# EAGLE design Fyve_Sicks (EAGLE 9.6.0)
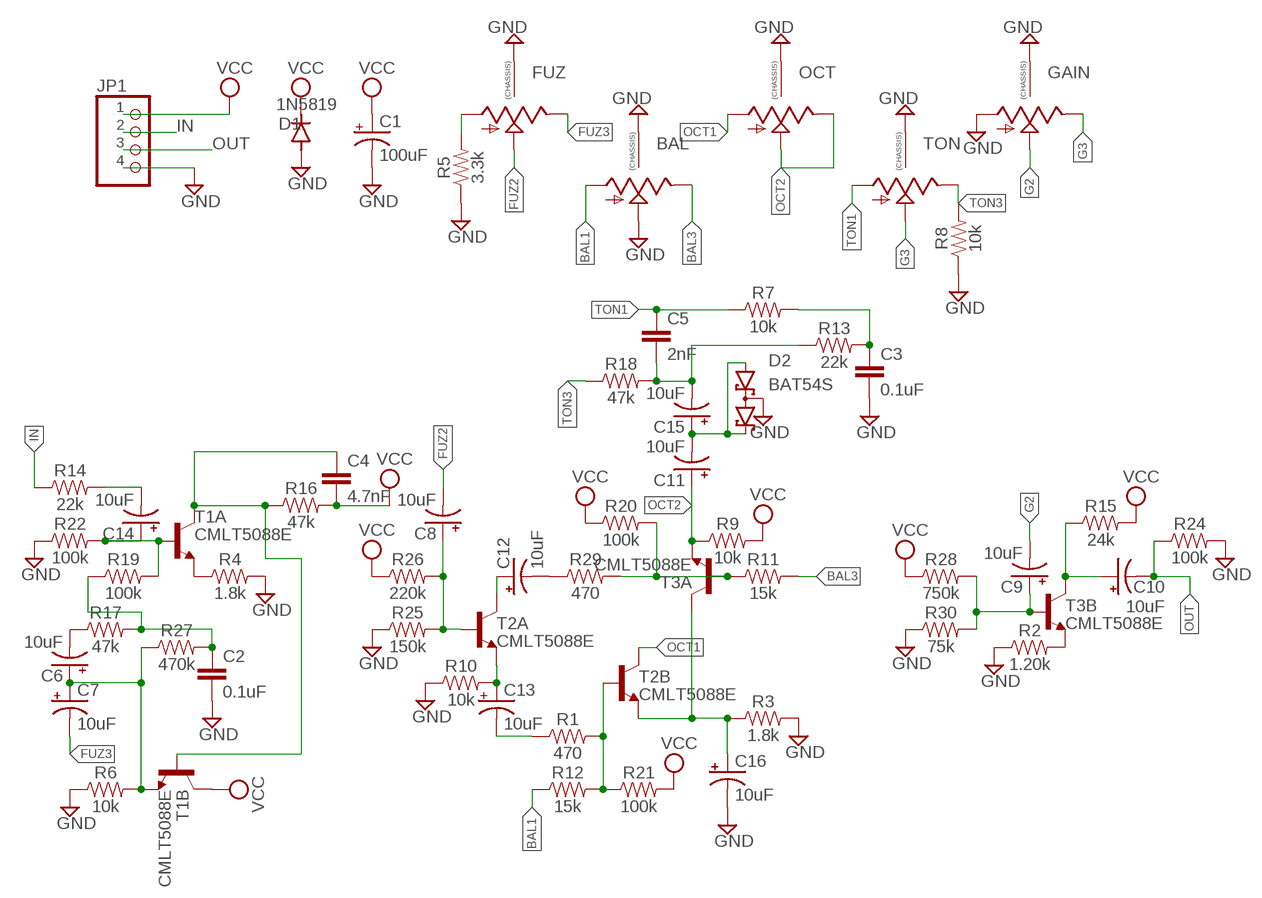
[diagram p0: schematic, sheet 1]

## Parts
BAL  9MM_SNAP-IN_POT_CHASSIS  [9MM_SNAP-IN_POT]
C1  100uF  CAP_SMD+THRUPAN_B  [PAN_B_SMD+THRU]
C2  0.1uF  0.1UF-0603-25V-(+80/-20%)  [0603]
C3  0.1uF  0.1UF-0603-25V-(+80/-20%)  [0603]
C4  4.7nF  4.7PF-0603-50V-5%  [0603]
C5  2nF  2.2NF/2200PF-0603-50V-10%  [0603]
C6  10uF  10UF-POLAR-EIA3528-20V-10%(TANT)  [EIA3528]
C7  10uF  10UF-POLAR-EIA3528-20V-10%(TANT)  [EIA3528]
C8  10uF  10UF-POLAR-EIA3528-20V-10%(TANT)  [EIA3528]
C9  10uF  10UF-POLAR-EIA3528-20V-10%(TANT)  [EIA3528]
C10  10uF  10UF-POLAR-EIA3528-20V-10%(TANT)  [EIA3528]
C11  10uF  10UF-POLAR-EIA3528-20V-10%(TANT)  [EIA3528]
C12  10uF  10UF-POLAR-EIA3528-20V-10%(TANT)  [EIA3528]
C13  10uF  10UF-POLAR-EIA3528-20V-10%(TANT)  [EIA3528]
C14  10uF  10UF-POLAR-EIA3528-20V-10%(TANT)  [EIA3528]
C15  10uF  10UF-POLAR-EIA3528-20V-10%(TANT)  [EIA3528]
C16  10uF  10UF-POLAR-EIA3528-20V-10%(TANT)  [EIA3528]
D1  1N5819  DIODE-SOD123  [SOD123]
D2  BAT54S  [SOT23]
FUZ  9MM_SNAP-IN_POT_CHASSIS  [9MM_SNAP-IN_POT]
GAIN  9MM_SNAP-IN_POT_CHASSIS  [9MM_SNAP-IN_POT]
JP1  PINHD-1X4  [1X04]
OCT  9MM_SNAP-IN_POT_CHASSIS  [9MM_SNAP-IN_POT]
R1  470  470OHM-0603-1/10W-1%  [0603]
R2  1.20k  1.20KOHM-0603-1/10W-1%  [0603]
R3  1.8k  1.8KOHM-0603-1/10W-1%  [0603]
R4  1.8k  1.8KOHM-0603-1/10W-1%  [0603]
R5  3.3k  3.3KOHM-0603-1/10W-1%  [0603]
R6  10k  10KOHM-0603-1/10W-1%  [0603]
R7  10k  10KOHM-0603-1/10W-1%  [0603]
R8  10k  10KOHM-0603-1/10W-1%  [0603]
R9  10k  10KOHM-0603-1/10W-1%  [0603]
R10  10k  10KOHM-0603-1/10W-1%  [0603]
R11  15k  15KOHM-0603-1/10W-1%  [0603]
R12  15k  15KOHM-0603-1/10W-1%  [0603]
R13  22k  22KOHM-0603-1/10W-1%  [0603]
R14  22k  22KOHM-0603-1/10W-1%  [0603]
R15  24k  22KOHM-0603-1/10W-1%  [0603]
R16  47k  47KOHM-0603-1/10W-1%  [0603]
R17  47k  47KOHM-0603-1/10W-1%  [0603]
R18  47k  47KOHM-0603-1/10W-1%  [0603]
R19  100k  100KOHM-0603-1/10W-1%  [0603]
R20  100k  100KOHM-0603-1/10W-1%  [0603]
R21  100k  100KOHM-0603-1/10W-1%  [0603]
R22  100k  100KOHM-0603-1/10W-1%  [0603]
R24  100k  100KOHM-0603-1/10W-1%  [0603]
R25  150k  150KOHM-0603-1/10W-1%  [0603]
R26  220k  220KOHM-0603-1/10W-1%  [0603]
R27  470k  470OHM-0603-1/10W-1%  [0603]
R28  750k  750OHM-0603-1/10W-1%  [0603]
R29  470  470OHM-0603-1/10W-1%  [0603]
R30  75k  75KOHM-0603-1/10W-1%  [0603]
T1  CMLT5088E  [SOT563]
T2  CMLT5088E  [SOT563]
T3  CMLT5088E  [SOT563]
TON  9MM_SNAP-IN_POT_CHASSIS  [9MM_SNAP-IN_POT]

## Nets
BAL1: BAL.1(A) R12.1
BAL3: BAL.3(E) R11.2
FUZ2: C8.C(-) FUZ.2(S)
FUZ3: C7.C(-) FUZ.3(E)
G2: C9.C(-) GAIN.2(S)
G3: GAIN.3(E) TON.2(S)
GND: BAL.2(S) BAL.CHASSIS1 BAL.CHASSIS2 C1.- C1.--(-) C2.2 C3.2 C16.C(-) D1.A D2.3(C1A2) FUZ.CHASSIS1 FUZ.CHASSIS2 GAIN.1(A) GAIN.CHASSIS1 GAIN.CHASSIS2 JP1.4 OCT.CHASSIS1 OCT.CHASSIS2 R2.1 R3.2 R4.2 R5.1 R6.1 R8.1 R10.1 R22.1 R24.2 R25.1 R30.1 TON.CHASSIS1 TON.CHASSIS2
IN: JP1.2 R14.1
N$1: FUZ.1(A) R5.2
N$2: C13.C(-) R1.1
N$3: C2.1 R17.2 R19.1 R27.2
N$4: R1.2 R12.2 R21.1 T2.5(B:B)
N$5: R11.1 R20.2 R29.2 T3.2(A:B)
N$6: C12.C(-) R29.1
N$7: C12.A(+) T2.6(A:C)
N$8: C11.C(-) C15.A(+) D2.1(A1) D2.2(C2)
N$9: C5.2 C15.C(-) R13.1 R18.2
N$10: C3.1 R7.2 R13.2
N$11: C9.A(+) R28.2 R30.2 T3.5(B:B)
N$12: R2.2 T3.4(B:E)
N$13: C10.A(+) R15.1 T3.3(B:C)
N$14: C6.A(+) C7.A(+) R6.2 R27.1 T1.4(B:E)
N$15: C14.C(-) R14.2
N$16: C14.A(+) R19.2 R22.2 T1.2(A:B)
N$17: C6.C(-) R17.1
N$18: C8.A(+) R25.2 R26.2 T2.2(A:B)
N$19: R4.1 T1.1(A:E)
N$20: C13.A(+) R10.2 T2.1(A:E)
N$21: C4.1 R16.1 T1.5(B:B) T1.6(A:C)
N$22: C16.A(+) R3.1 T2.4(B:E) T3.6(A:C)
OCT1: OCT.1(A) T2.3(B:C)
OCT2: C11.A(+) OCT.2(S) OCT.3(E) R9.1 T3.1(A:E)
OUT: C10.C(-) JP1.3 R24.1
TON1: C5.1 R7.1 TON.1(A)
TON3: R8.2 R18.1 TON.3(E)
VCC: C1.+ C1.++(+) C4.2 D1.C JP1.1 R9.2 R15.2 R16.2 R20.1 R21.2 R26.1 R28.1 T1.3(B:C)

## Library data of the parts
BAL FUZ GAIN OCT TON = MusicThingModular:9MM_SNAP-IN_POT_CHASSIS: 9mm vertical snap-in pot, Alpha / Panasonic style, with a connection to the metal chassis for grounding
C1 = MusicThingModular:CAP_SMD+THRU
C2 C3 = SparkFun-Capacitors:0.1UF: 0.1µF ceramic capacitors A capacitor is a passive two-terminal electrical component used to store electrical energy temporarily in an electric field.; PROD_ID: CAP-00810
C4 = SparkFun-Capacitors:4.7PF: 4.7pF ceramic capacitors A capacitor is a passive two-terminal electrical component used to store electrical energy temporarily in an electric field.; PROD_ID: CAP-07880; VALUE: 4.7pF
C5 = SparkFun-Capacitors:2.2NF/2200PF: 2.2nF/2,200pF ceramic capacitors A capacitor is a passive two-terminal electrical component used to store electrical energy temporarily in an electric field.; PROD_ID: CAP-07877; VALUE: 2.2nF
C6-C16 = SparkFun-Capacitors:10UF-POLAR: 10.0µF polarized capacitors A capacitor is a passive two-terminal electrical component used to store electrical energy temporarily in an electric field.; PROD_ID: CAP-08063
D1 = diode:DIODE-: DIODE
D2 = diode:BAT54S: Schottky Diodes Pin connection corrected 2011-05-04 Source: Fairchild .. BAT54.pdf
JP1 = Connector:PINHD-1X4: PIN HEADER; CATEGORY: CONNECTOR; SUB-CATEGORY: PIN-HEADER
R1 R29 = SparkFun-Resistors:470OHM: 470Ω resistor A resistor is a passive two-terminal electrical component that implements electrical resistance as a circuit element. Resistors act to reduce current flow, and, at the same time, act to lower voltage levels within circuits. - Wikipedia; PROD_ID: RES-07869
R2 = SparkFun-Resistors:1.20KOHM: 1.20kΩ resistor A resistor is a passive two-terminal electrical component that implements electrical resistance as a circuit element. Resistors act to reduce current flow, and, at the same time, act to lower voltage levels within circuits. - Wikipedia; PROD_ID: RES-08413
R3 R4 = SparkFun-Resistors:1.8KOHM: 1.8kΩ resistor A resistor is a passive two-terminal electrical component that implements electrical resistance as a circuit element. Resistors act to reduce current flow, and, at the same time, act to lower voltage levels within circuits. - Wikipedia; PROD_ID: RES-09119
R5 = SparkFun-Resistors:3.3KOHM: 3.3kΩ resistor A resistor is a passive two-terminal electrical component that implements electrical resistance as a circuit element. Resistors act to reduce current flow, and, at the same time, act to lower voltage levels within circuits. - Wikipedia; PROD_ID: RES-07851
R6-R10 = SparkFun-Resistors:10KOHM: 10kΩ resistor A resistor is a passive two-terminal electrical component that implements electrical resistance as a circuit element. Resistors act to reduce current flow, and, at the same time, act to lower voltage levels within circuits. - Wikipedia; PROD_ID: RES-00824
R11 R12 = SparkFun-Resistors:15KOHM: 15kΩ resistor A resistor is a passive two-terminal electrical component that implements electrical resistance as a circuit element. Resistors act to reduce current flow, and, at the same time, act to lower voltage levels within circuits. - Wikipedia; PROD_ID: RES-07854
R13 R14 = SparkFun-Resistors:22KOHM: 22kΩ resistor A resistor is a passive two-terminal electrical component that implements electrical resistance as a circuit element. Resistors act to reduce current flow, and, at the same time, act to lower voltage levels within circuits. - Wikipedia; PROD_ID: RES-07853
R15 = SparkFun-Resistors:22KOHM: 22kΩ resistor A resistor is a passive two-terminal electrical component that implements electrical resistance as a circuit element. Resistors act to reduce current flow, and, at the same time, act to lower voltage levels within circuits. - Wikipedia; PROD_ID: RES-07853; VALUE: 22k
R16-R18 = SparkFun-Resistors:47KOHM: 47kΩ resistor A resistor is a passive two-terminal electrical component that implements electrical resistance as a circuit element. Resistors act to reduce current flow, and, at the same time, act to lower voltage levels within circuits. - Wikipedia; PROD_ID: RES-07871
R19-R22 R24 = SparkFun-Resistors:100KOHM: 100kΩ resistor A resistor is a passive two-terminal electrical component that implements electrical resistance as a circuit element. Resistors act to reduce current flow, and, at the same time, act to lower voltage levels within circuits. - Wikipedia; PROD_ID: RES-07828
R25 = SparkFun-Resistors:150KOHM: 150kΩ resistor A resistor is a passive two-terminal electrical component that implements electrical resistance as a circuit element. Resistors act to reduce current flow, and, at the same time, act to lower voltage levels within circuits. - Wikipedia; PROD_ID: RES-09117
R26 = SparkFun-Resistors:220KOHM: 220kΩ resistor A resistor is a passive two-terminal electrical component that implements electrical resistance as a circuit element. Resistors act to reduce current flow, and, at the same time, act to lower voltage levels within circuits. - Wikipedia; PROD_ID: RES-08969
R27 = SparkFun-Resistors:470OHM: 470Ω resistor A resistor is a passive two-terminal electrical component that implements electrical resistance as a circuit element. Resistors act to reduce current flow, and, at the same time, act to lower voltage levels within circuits. - Wikipedia; PROD_ID: RES-07869; VALUE: 470
R28 = SparkFun-Resistors:750OHM: 750Ω resistor A resistor is a passive two-terminal electrical component that implements electrical resistance as a circuit element. Resistors act to reduce current flow, and, at the same time, act to lower voltage levels within circuits. - Wikipedia; PROD_ID: RES-07824; VALUE: 750
R30 = SparkFun-Resistors:75KOHM: 75Ω resistor A resistor is a passive two-terminal electrical component that implements electrical resistance as a circuit element. Resistors act to reduce current flow, and, at the same time, act to lower voltage levels within circuits. - Wikipedia; PROD_ID: RES-09737; VALUE: 75
T1-T3 = transistor-neu-to92:CMLT5088E: DUAL NPN/NPN L88 TRANSISTORS ENHANCED SPECIFICATION PICOmini(TM) SURFACE MOUNT Source: CMLT5078%20SERIES.pdf

## Board
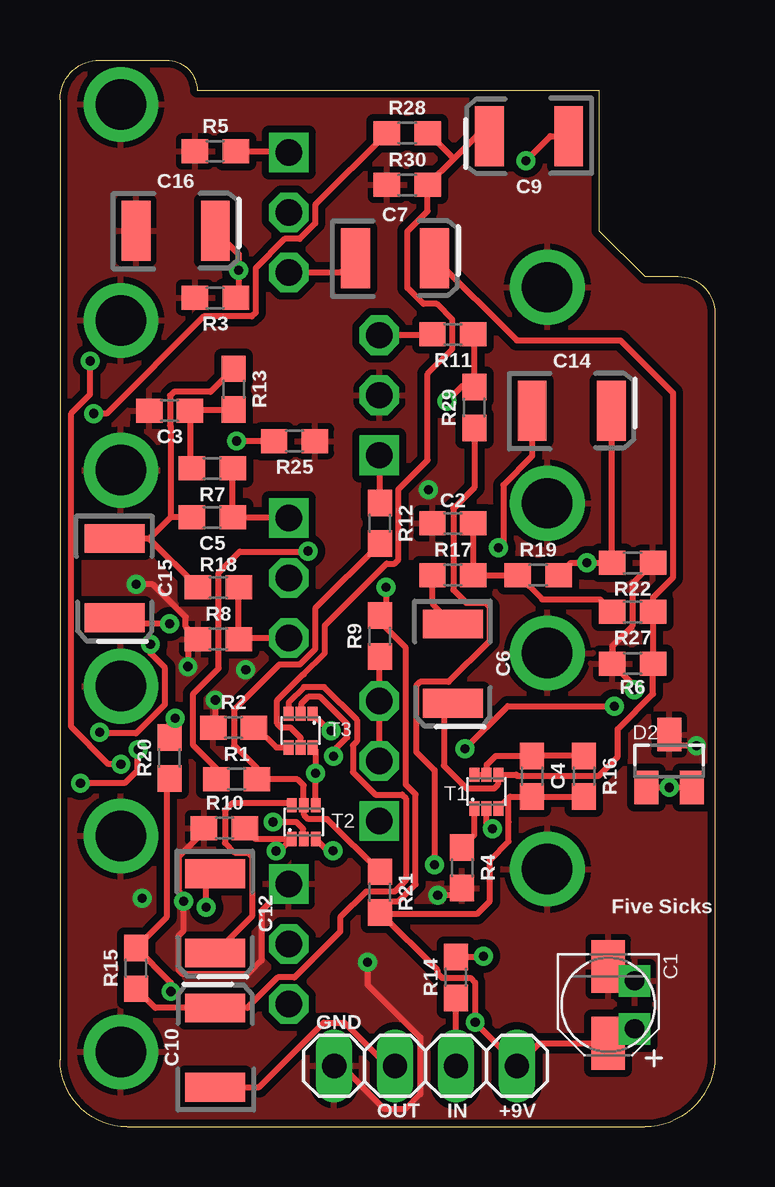
[diagram p1: board, top side]
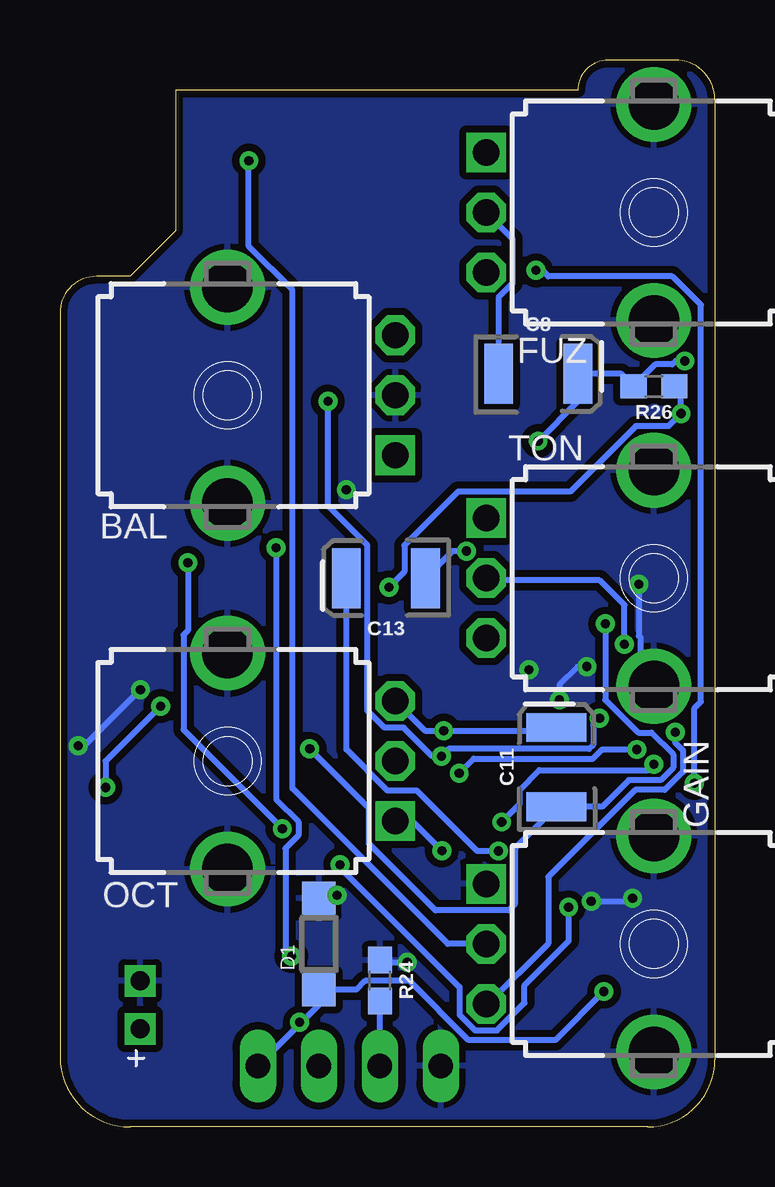
[diagram p2: board, bottom side, seen from below]

Size 27.3 x 44.45 mm. Coordinates in mm from the lower left corner, seen from the top.
Outline: 2.79,0 24.38,0 arc90 27.3,2.92 27.3,33.91 arc90 25.78,35.43 24.38,35.43 22.48,37.34 22.48,43.18 5.71,43.18 arc90 4.45,44.45 1.65,44.45 arc90 0,42.8 0,2.79 arc90 2.79,0
Copper layers (1*16): Top 0.035mm / dielectric 1.5mm / Bottom 0.035mm
Design rules "default *": minimum track width 6mil, minimum drill 0.35mm, track to track 6mil, track to pad 6mil, pad to pad 6mil, via to via 6mil, smd to smd 6mil, copper to edge 8mil, drill to drill 6mil, minimum pad ring 10mil, minimum via ring 8mil, stop-mask expansion 4mil, vias tented up to drill 0mil, thermal gap 10mil

### Footprints (pad centres in the part's own frame; a part is rotated, then mirrored left to right if it is on the bottom)
9MM_SNAP-IN_POT = drill 1.1 square: 1 -2.5,-7 | drill 1.1 octagon: 2 0,-7; 3 2.5,-7 | drill 2.1 pad 2.794: CHASSIS1 -4.5,0; CHASSIS2 4.5,0
PAN_B_SMD+THRU = smd 2.2 x 1.4: + 1.6,0; - -1.6,0 | drill 0.8 pad 0.9 square: ++ 1,1.1; -- -1,1.1
0603 = smd 1.1 x 1: 1 -0.85,0; 2 0.85,0
EIA3528 = smd 1.2 x 2.5: A 1.65,0; C -1.65,0
SOD123 = smd 1.4 x 1.4: A 1.9,0; C -1.9,0
SOT23 = smd 1 x 1.4: 1 -0.95,-1.1; 2 0.95,-1.1; 3 0,1.1
1X04 = drill 1.016 long: 1 -3.81,0; 2 -1.27,0; 3 1.27,0; 4 3.81,0
SOT563 = smd 0.4 x 0.6: 1 -0.5,-0.7; 2 0,-0.7; 3 0.5,-0.7; 4 0.5,0.7; 5 0,0.7; 6 -0.5,0.7

### Placement (x,y rotation side)
BAL  20.32,30.48 90 bottom
C1  22.86,5.08 270 top
C2  16.38,25.15 180 top
C3  4.57,29.84 180 top
C4  19.68,14.61 270 top
C5  6.35,25.4 180 top
C6  16.38,19.3 270 top
C7  13.97,36.2 0 top
C8  7.37,31.37 0 bottom
C9  19.56,41.27 180 top
C10  6.48,3.3 90 top
C11  6.6,14.99 90 bottom
C12  6.48,8.89 270 top
C13  13.72,22.86 180 bottom
C14  21.34,29.84 0 top
C15  2.29,22.86 270 top
C16  4.83,37.34 0 top
D1  16.51,7.62 90 bottom
D2  25.4,15.24 0 top
FUZ  2.54,38.1 270 bottom
GAIN  2.54,7.62 270 bottom
JP1  15.24,2.54 180 top
OCT  20.32,15.24 90 bottom
R1  7.37,14.48 0 top
R2  7.24,16.64 0 top
R3  6.48,34.54 180 top
R4  16.76,10.79 270 top
R5  6.48,40.64 0 top
R6  23.88,19.3 0 top
R7  6.35,27.43 180 top
R8  6.6,20.32 0 top
R9  13.34,20.45 90 top
R10  6.86,12.45 0 top
R11  16.38,33.02 180 top
R12  13.34,25.15 270 top
R13  7.24,30.73 270 top
R14  16.51,6.22 90 top
R15  3.17,6.6 90 top
R16  21.84,14.61 270 top
R17  16.38,22.99 0 top
R18  6.6,22.48 180 top
R19  19.94,22.99 0 top
R20  4.57,15.37 90 top
R21  13.34,9.78 270 top
R22  23.88,23.5 180 top
R24  13.97,6.1 90 bottom
R25  9.78,28.57 180 top
R26  2.54,30.86 180 bottom
R27  23.88,21.46 180 top
R28  14.48,41.4 0 top
R29  17.27,29.97 90 top
R30  14.48,39.24 0 top
T1  17.78,13.97 0 top
T2  10.16,12.7 0 top
T3  10.03,16.51 180 top
TON  2.54,22.86 270 bottom

### Tracks (layer width: path | path; a pad name or v marks a point on that pad's centre or on a via)
BAL1
  Top 0.254: BAL.1 13.32,26.01 R12.1
BAL3
  Top 0.254: R11.2 15.49,32.98 BAL.3
FUZ2
  Bottom 0.254: C8.C 9.02,34.56 8.44,35.14 8.44,37 FUZ.2
FUZ3
  Top 0.254: FUZ.3 11.72,35.6 C7.C
G2  (via drill 0.38)
  Top 0.254: v19.43,40.26 20.45,41.27 C9.C
  Bottom 0.254: GAIN.2 11.13,7.62 17.61,14.1 17.61,34.87 19.43,36.69 v19.43,40.26
G3  (via drill 0.38)
  Top 0.254: v1.65,16.43 1.69,16.4 3.17,16.4 4.38,17.6 4.38,19.12 3.77,19.73 v3.77,20.1
  Bottom 0.254: GAIN.3 9.46,5.12 6.95,7.63 6.95,10.41 3.33,14.03 2.09,14.03 1.33,14.79 1.33,15.69 1.65,16 v1.65,16.43 | TON.2 9.45,22.77 4.8,22.77 3.77,21.74 v3.77,20.1
GND  (via drill 0.38)
  Top 0.254: JP1.4 11.73,2.54 13.54,0.74 14.4,0.74 15.01,1.35 15.01,3.73 12.83,5.92 v12.83,6.86 | GAIN.1 8.41,8.99 8.41,6.93 7.84,6.36 5.11,6.36 4.95,6.52 4.95,7.96 5.16,8.16 v5.16,9.39 5.16,9.62 4.95,9.82 4.95,11.26 6.01,12.32 R10.1 | R22.1 23.86,22.62 23.86,20.85 23.03,20.02 R6.1 23.95,18.38 v23.95,18.21 | v26.54,15.88 25.86,15.88 D2.3 | v5.33,19.18 5.33,19.94 5.63,20.23 5.67,20.23 R8.1 5.25,20.83 5.25,21.23 3.87,22.61 v3.17,22.61 | v6.48,17.78 6.48,16.73 R2.1 | R4.2 16.47,9.65 v15.75,9.65
  Bottom 0.254: R24.2 13.88,6.86 v12.83,6.86 | v5.16,9.39 3.56,9.39 v3.43,9.53 | v23.95,18.21 26.29,15.88 v26.54,15.88 | v5.33,19.18 5.71,19.18 6.48,18.41 v6.48,17.78 | v3.17,22.61 3.17,20.46 3.1,20.38 3.1,18.92 TON.CHASSIS2 | v15.75,9.65 16.38,9.65 D1.A
  other vias: 15.37,26.54 7.75,19.05
  pour Bottom (isolate 0.305): -1.02,45.59 -1.02,-0.76 -0.64,-1.14 28.32,-1.14 28.57,-0.89 28.57,45.21 28.32,45.47 -0.89,45.47
  pour Top (isolate 0.305): -0.89,45.47 -0.89,-0.76 -0.64,-1.02 28.19,-1.02 28.57,-0.64 28.57,45.21 28.32,45.47
IN
  Top 0.254: JP1.2 R14.1
N$1
  Top 0.254: R5.2 9.5,40.64 FUZ.1
N$2  (via drill 0.38)
  Top 0.254: R1.1 6.52,14.94 5.56,15.89 5.56,18.05 6.62,19.11 6.62,23.09 7.49,23.96 10.33,23.96 v10.35,23.99
  Bottom 0.254: v10.35,23.99 10.94,23.99 C13.C
N$3
  Top 0.254: C2.1 R17.2 R19.1 20.11,21.97 22.52,21.97 R27.2
N$4
  Top 0.254: R21.1 11.14,12.82 10.34,12.82 10.18,12.98 10.18,13.38 T2.5 10.16,14.22 9.91,14.48 R1.2 8.22,14.94 7.26,15.89 7.26,17.38 9.13,19.26 10,19.26 10.64,19.9 10.64,21.61 R12.2
N$5  (via drill 0.38)
  Top 0.254: R29.2 17.27,30.86 | 17.27,30.86 17.27,32.98 R11.1 | v11.41,15.44 11.41,15.66 11.98,16.23 11.98,16.79 10.85,17.92 10.34,17.92 10.05,17.63 10.05,17.36 10.03,17.34 T3.2 | v16.13,30.23 16.76,30.86 17.27,30.86 | R20.2 4.57,16.78 v4.81,17.02
  Bottom 0.254: v16.13,30.23 16.13,25.87 14.49,24.23 14.49,17.34 13.78,16.64 12.98,16.64 11.79,15.44 v11.41,15.44 11.1,15.75 5.25,15.75 5.08,15.92 5.08,16.75 v4.81,17.02
N$6  (via drill 0.38)
  Top 0.254: R29.1 17.27,26.63 16.4,25.76 16.4,22.37 16.94,21.83 17.75,21.83 17.91,21.67 17.91,20.24 16.21,18.53 15.02,18.53 14.85,18.37 14.85,15.63 15.62,14.86 v15.62,10.92 | v6.1,9.14 6.1,10.16 C12.C
  Bottom 0.254: v6.1,9.14 6.1,7.75 7.94,5.91 7.94,5.16 9.08,4.02 10,4.02 10.64,4.66 10.64,5.82 15.62,10.79 v15.62,10.92
N$7
  Top 0.254: C12.A 8.01,8.77 8.01,11.26 7.84,11.42 7.29,11.42 6.88,11.83 6.88,13.19 7.17,13.48 9.58,13.48 T2.6
N$8  (via drill 0.38)
  Top 0.254: D2.1 v25.4,14.14 D2.2 | v4.57,20.95 2.54,20.95 C15.A | v16.89,15.75 18.67,17.53 v23.11,17.53
  Bottom 0.254: v4.57,20.95 4.57,17.79 3.2,16.42 2.64,16.42 1.74,15.52 1.74,14.96 2.26,14.44 3.59,14.44 4.7,13.34 C11.C 8.34,11.6 8.34,9.27 8.6,9.02 11.64,9.02 14.42,11.8 14.42,13.28 v16.89,15.75 | v23.11,17.53 25.4,15.24 v25.4,14.14
N$9
  Top 0.254: R18.2 3.72,24.51 | 3.72,24.51 C15.C | C5.2 4.61,25.4 | 4.61,25.4 3.72,24.51 | R13.1 6.28,30.62 4.76,30.62 4.59,30.46 4.59,29.23 4.61,29.21 4.61,25.4
N$10
  Top 0.254: R7.2 5.42,27.51 C3.1 5.46,29.88 R13.2
N$11
  Top 0.254: 16.43,40.34 R30.2 15.33,38.15 14.49,37.31 14.49,34.96 15.16,34.28 15.71,34.28 16.36,33.64 16.36,32.4 15.33,31.37 15.33,27.77 14.11,26.56 14.11,23.63 13.95,23.47 13.62,23.47 11.05,20.89 11.05,19.73 10.17,18.85 10.13,18.85 9.05,17.77 9.05,16.79 9.22,16.63 9.61,16.63 10.03,16.2 T3.5 | 16.43,40.34 17.36,41.27 C9.A | R28.2 15.37,41.4 16.43,40.34
N$12
  Top 0.254: R2.2 8.2,16.64 9.03,15.81 T3.4
N$13
  Top 0.254: R15.1 3.98,4.95 C10.A 7.81,4.95 9.08,6.22 9.78,6.22 11.68,8.13 11.68,8.72 12.76,9.8 13.95,9.8 14.42,10.27 14.42,13.68 14.26,13.84 13.15,13.84 12.22,14.78 12.22,15.89 12.38,16.06 12.38,16.96 11.02,18.32 10.18,18.32 9.53,17.68 T3.3
N$14
  Top 0.254: C7.A 19.05,32.77 23.37,32.77 25.55,30.58 25.55,22.88 24.73,22.05 R27.1 R6.2 24.73,18.03 23.26,16.57 23.26,15.42 22.46,14.63 19.07,14.63 19.02,14.67 T1.4 18.26,14.65 18.26,14.25 18.1,14.09 16.96,14.09 16,15.05 16,17.27 C6.A
N$15  (via drill 0.38)
  Top 0.254: C14.C 19.69,27.94 18.48,26.74 18.48,24.32 v18.29,24.13 | v17.65,7.11 17.61,7.07 R14.2
  Bottom 0.254: v18.29,24.13 18.29,13.63 17.36,12.7 17.36,12.14 17.91,11.6 17.91,7.37 v17.65,7.11
N$16  (via drill 0.38)
  Top 0.254: R19.2 21.3,23.5 v21.97,23.5 22.86,23.5 | 22.86,23.5 R22.2 | C14.A 22.99,23.62 22.86,23.5 | v18.03,12.42 17.78,12.68 T1.2
  Bottom 0.254: v21.97,23.5 21.97,20.69 22.16,20.5 22.16,16.55 v18.03,12.42
N$17
  Top 0.254: C6.C 15.53,21.8 R17.1
N$18  (via drill 0.38)
  Top 0.254: R25.2 v7.37,28.57 | T2.2 10.14,12.02 10.14,12.42 9.86,12.7 v8.89,12.7 | v1.26,31.91 1.26,30.52 0.47,29.73 0.47,16.66 2.02,15.11 v2.54,15.11
  Bottom 0.254: v7.37,28.57 5.72,30.23 C8.A 3.9,31.37 R26.2 2.49,31.76 1.78,31.76 1.63,31.91 v1.26,31.91 | v8.89,12.7 8.13,13.46 8.13,14.05 7.33,14.86 2.79,14.86 v2.54,15.11
N$19
  Top 0.254: R4.1 17.28,12.16 T1.1
N$20  (via drill 0.38)
  Top 0.254: R10.2 8.15,12 T2.1 9.15,11.49 v9.02,11.49
  Bottom 0.254: v9.02,11.49 9.91,11.49 12.42,14.01 13.65,14.01 15.37,15.72 C13.A
N$21
  Top 0.254: R16.1 C4.1 18.17,15.46 17.8,15.09 17.8,14.69 T1.5 T1.6
N$22  (via drill 0.38)
  Top 0.254: T3.6 10.66,15.68 v10.66,14.73 T2.4 | C16.A 7.45,36.36 v7.45,35.69 7.45,34.67 R3.1 | v3.26,15.72 3.21,15.68 3.21,14.83 2.7,14.32 v0.86,14.32
  Bottom 0.254: v10.66,14.73 10.05,15.34 5.08,15.34 4.7,15.72 v3.26,15.72 | v0.86,14.32 0.86,17.45 0.58,17.72 0.58,34.24 1.78,35.44 6.95,35.44 7.2,35.69 v7.45,35.69
OCT1  (via drill 0.38)
  Top 0.254: T2.3 11.15,11.51 v11.38,11.51
  Bottom 0.254: v11.38,11.51 12.61,12.74 OCT.1
OCT2  (via drill 0.38)
  Top 0.254: v11.3,16.51 11.23,16.51 T3.1 | R9.1 13.32,19.58 OCT.3 OCT.2
  Bottom 0.254: OCT.3 12.09,16.51 v11.3,16.51 6.73,16.51 C11.A
OUT
  Top 0.254: C10.C 8.31,1.65 11,4.34 11.86,4.34 13.66,2.54 JP1.3
  Bottom 0.254: JP1.3 R24.1
TON1
  Top 0.254: R7.1 C5.1 9.5,25.4 TON.1
TON3
  Top 0.254: TON.3 7.49,20.36 R8.2 R18.1
VCC  (via drill 0.38)
  Top 0.254: C1.++ 23.46,4.08 C1.+ 19.99,3.48 JP1.1 19.05,2.61 v17.31,4.35 17.31,6.02 17.13,6.2 15.94,6.2 15.73,6.41 15.73,6.53 R21.2 | T1.3 18.7,13.69 | 18.7,13.69 18.77,13.76 C4.2 R16.2 | R20.1 4.45,14.39 4.45,8.72 R15.2 4.62,6.01 v4.62,5.64 | v1.41,29.72 1.94,29.72 5.99,33.77 7.99,33.77 8.16,33.93 8.16,35.78 9.37,37 10,37 10.64,37.64 10.64,38.42 R28.1 | v13.59,22.48 13.59,21.55 13.42,21.38 | 13.42,21.38 R9.2 | 18.7,13.69 18.7,12.71 18.71,12.7 18.71,11.89 17.92,11.11 17.92,9.41 17.38,8.86 13.4,8.86 R21.2 | R21.2 13.8,9.39 14.12,9.39 14.83,10.11 14.83,13.85 14.42,14.26 14.42,19.95 13.42,20.96 13.42,21.38
  Bottom 0.254: JP1.1 16.51,5.08 D1.C 14.94,5.72 14.59,6.08 12.73,6.08 10.26,3.61 6.65,3.61 v4.62,5.64 | R26.1 1.41,30.58 v1.41,29.72 1.93,29.2 3.3,29.2 6.03,26.46 10.71,26.46 12.95,24.23 12.95,23.12 v13.59,22.48

### Text on the board
tPlace: Five Sicks | GND | OUT | IN | +9V